# Altium schematic sheet ESP32-S3.SchDoc
size A4; SheetNumber: 2; SheetTotal: 7
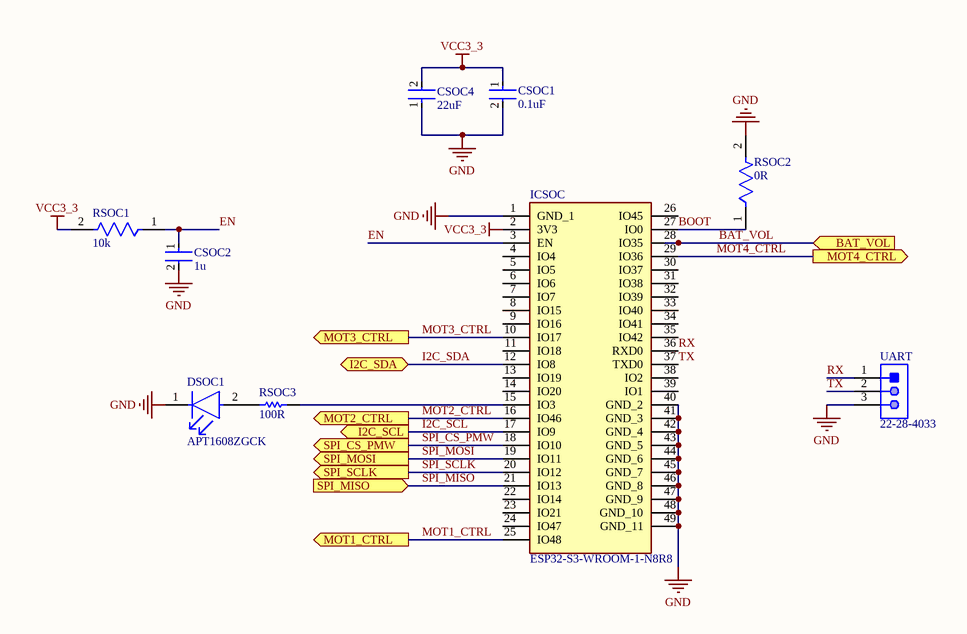
[diagram p0: ESP32-S3.SchDoc]

## Parts
CSOC1  0.1uF  [FP-CL10-IPC_C]
CSOC2  1u  [FP-CL10-IPC_A]
CSOC4  22uF  [FP-GRM188-0_2-IPC_C]
DSOC1  APT1608ZGCK  [FP-APT1608ZGCK-MFG]
ICSOC  ESP32-S3-WROOM-1-N8R8  [ESP32S3WROOM1N8R8]
RSOC1  10k  [FP-ERJ3G-IPC_C]
RSOC2  0R  [FP-ERJ-3GEY0R00V-MFG]
RSOC3  100R  [RESC1608X55X30LL15T15]
UART  22-28-4033  [MOLX-22-28-4033_V]

## Ports
BAT_VOL (in), I2C_SCL (out), I2C_SDA (bidir), MOT1_CTRL (out), MOT2_CTRL (out), MOT3_CTRL (out), MOT4_CTRL (out), SPI_CS_PMW (out), SPI_MISO (in), SPI_MOSI (out), SPI_SCLK (out)

## Nets
GND: CSOC1.2 CSOC2.2 CSOC4.1 DSOC1.1(C) ICSOC.1(GND_1) ICSOC.40(GND_2) ICSOC.41(GND_3) ICSOC.42(GND_4) ICSOC.43(GND_5) ICSOC.44(GND_6) ICSOC.45(GND_7) ICSOC.46(GND_8) ICSOC.47(GND_9) ICSOC.48(GND_10) ICSOC.49(GND_11) RSOC2.2 UART.3
VCC3_3: CSOC1.1 CSOC4.2 ICSOC.2(3V3) RSOC1.2
BAT_VOL: ICSOC.28(IO35) ; port BAT_VOL
BOOT: ICSOC.27(IO0) RSOC2.1
EN: CSOC2.1 ICSOC.3(EN) RSOC1.1
I2C_SCL: ICSOC.17(IO9) ; port I2C_SCL
I2C_SDA: ICSOC.12(IO8) ; port I2C_SDA
MOT1_CTRL: ICSOC.25(IO48) ; port MOT1_CTRL
MOT2_CTRL: ICSOC.16(IO46) ; port MOT2_CTRL
MOT3_CTRL: ICSOC.10(IO17) ; port MOT3_CTRL
MOT4_CTRL: ICSOC.29(IO36) ; port MOT4_CTRL
RX: ICSOC.36(RXD0) UART.1
SPI_CS_PMW: ICSOC.18(IO10) ; port SPI_CS_PMW
SPI_MISO: ICSOC.21(IO13) ; port SPI_MISO
SPI_MOSI: ICSOC.19(IO11) ; port SPI_MOSI
SPI_SCLK: ICSOC.20(IO12) ; port SPI_SCLK
TX: ICSOC.37(TXD0) UART.2
NetDSOC1_2: DSOC1.2(A) RSOC3.2
NetICSOC_15: ICSOC.15(IO3) RSOC3.1

Not connected (* = marked no-connect by the designer): ICSOC 4(IO4) 5(IO5) 6(IO6) 7(IO7) 8(IO15) 9(IO16) 11(IO18) 13(IO19) 14(IO20) 22(IO14) 23(IO21) 24(IO47) 26(IO45) 30(IO37) 31(IO38) 32(IO39) 33(IO40) 34(IO41) 35(IO42) 38(IO2) 39(IO1)

## Library data of the parts
CSOC1 = CMP-13271-001724-1: Cap Ceramic 100nF 50V X7R ±20% Pad SMD 0603 +125°C T/R; Mount: Surface Mount; Lead Free: Lead Free; Max Operating Temperature: 125°C; Voltage Rating: 50V; Case Code (Imperial): 0603; Capacitance: 100nF; Height: 0.8mm; Length: 1.6mm; Tolerance: 20%; Case Code (Metric): 1608; Thickness: 0.035inch; Depth: 0.8mm; Width: 0.031inch; Package Quantity: 1; Min Operating Temperature: -55°C; Case/Package: 0603; Radiation Hardening: No; Voltage Rating (DC): 50V; Dielectric: X7R; Packaging: Tape and Reel
CSOC2 = CMP-13271-001174-1: Cap Ceramic 1uF 25V X5R ±10% Pad SMD 0603 +85°C T/R; Min Operating Temperature: -55°C; Dielectric: X5R; Mount: Surface Mount; Lead Free: Lead Free; Capacitance: 1uF; Height: 0.8mm; Case/Package: 0603; Depth: 0.8mm; Radiation Hardening: No; Width: 0.031inch; Tolerance: 10%; Voltage Rating: 25V; Thickness: 0.035inch; Max Operating Temperature: 85°C; Packaging: Tape and Reel; Package Quantity: 15000; Length: 1.6mm; Voltage Rating (DC): 25V
CSOC4 = CMP-2000-06337-3: Chip Multilayer Ceramic Capacitors for General Purpose, 0603, 22uF, X5R, 15%, 20%, 10V; Tolerance: 20%; Weight: 0.000222oz; Material: Ceramic; Depth: 0.8mm; Length: 1.6mm; Termination: SMD/SMT; Capacitance: 22uF; Packaging: Tape and Reel; Width: 0.8mm; Voltage Rating: 10V; Case Code (Imperial): 0603; Mount: Surface Mount; Voltage Rating (DC): 10V; Case/Package: 0603; Thickness: 0.039inch; REACH SVHC: No SVHC; Dielectric: X5R; Height: 0.8mm; Package Quantity: 4000; Case Code (Metric): 1608; Min Operating Temperature: -55°C; Lead Free: Lead Free; Max Operating Temperature: 85°C
DSOC1 = CMP-44529-000024-1: LED GREEN CLEAR CHIP SMD; Forward Voltage: 3.3V; Dominant Wavelength: 525nm; Forward Current: 20mA; Lens Color: Colorless; Viewing Angle: 120°; Luminous Intensity: 350mcd; Lens Transparency: Clear; Color: Green; Max Operating Temperature: 85°C; Case/Package: 0603; Mount: Surface Mount; Min Operating Temperature: -40°C; Case Code (Metric): 1608; Test Current: 20mA; Packaging: Tape and Reel; Width: 0.8mm; Package Quantity: 1; Height: 0.75mm; Length: 1.6mm; Illumination Color: Green; Lead Free: Lead Free; Case Code (Imperial): 0603
ICSOC = CMP-006-000000-1: Integrated Circuit; Manufacturer_Name: Espressif Systems; Datasheet Link: https://www.espressif.com/sites/default/files/documentation/esp32-s3-wroom-1_wroom-1u_datasheet_en.pdf; Source: SamacSys.SchLib; Manufacturer_Part_Number: ESP32-S3-WROOM-1-N8R8; Height: 3.25mm; Design Item ID: ESP32-S3-WROOM-1-N8R8
RSOC1 = CMP-2000-00704-2: RES SMD 10K OHM 5% 1/10W 0603; Temperature Coefficient: 200ppm/°C; Max Power Dissipation: 100mW; Resistance: 10kR; Voltage Rating (DC): 50V; Voltage Rating: 75V; Resistor Type: Thick Film; Tolerance: 5%; Military Standard: Not; Package Quantity: 1; Max Operating Temperature: 155°C; Mount: Surface Mount; Technology: THICK FILM; Case/Package: 0603; Construction: Rectangular; Depth: 0.8mm; Case Code (Imperial): 0603; Weight: 7.1E-05oz; Features: Automotive AEC-Q200; Packaging: Tape and Reel; Width: 0.8mm; Length: 1.6mm; Termination: SMD/SMT; Power Rating: 100mW; Lead Free: Lead Free; Number of Terminations: 2; Height: 0.45mm; RoHS Compliant: Yes; Min Operating Temperature: -55°C; Contact Plating: Tin; REACH SVHC: No SVHC; Resistance Tolerance: 5%; Series: ERJ; Working Voltage: 75V; Case Code (Metric): 1608
RSOC2 = CMP-2000-00700-2: RES SMD 0 OHM JUMPER 1/10W 0603; Manufacturer Part Number: ERJ-3GEY0R00V; Manufacturer: Panasonic; Tolerance: 5%; Description: 0 Ohms Jumper 0.1W, 1/10W Chip Resistor 0603 (1608 Metric) Automotive AEC-Q200 Thick Film; Automotive Grade: Grade 0; Voltage Rating: 75V; Value: 0Ω; Temperature Coefficient: -100/+600ppm/°C; Power Rating: 0.1W; Mouser Description: Resistor, Chip Thick Film, 0 Ohm, 0.1w, Resistor, Chip Thick Film, 0 Ohm, 0.1w, 5%; Ipc Land Pattern Name: RESC16080X45; Category: Res; Package: 0603; Temperature: -55°C to +155°C; Temperature Range Low: -55°C; Series: ERJ; Resistance: 0Ω; RoHS: TRUE; Composition: Thick Film; Octopart: https://octopart.com/erj-3gey0r00v-panasonic-55389238; Device Class L1: Passive Components; Footprint Url: https://industrial.panasonic.com/cdbs/www-data/pdf/RDA0000/DMA0000COL17.pdf; ComponentLink2Description: Datasheet; Device Class L2: Resistors; Temperature Range High: +155°C; Digikey Description: RES SMD 0 OHM JUMPER 1/10W 0603; Lead Free: Yes; Device Class L3: Chip SMD Resistors; Height: 0.55mm; ComponentLink2URL: https://industrial.panasonic.com/cdbs/www-data/pdf/RDA0000/AOA0000C301.pdf; Automotive: Yes
RSOC3 = CMP-2000-00179-1: Manufacturer: Panasonic; Part Number: ERJ-3EKF1000V
UART = CMP-1676-00001-5: Male Header, Pitch 2.54 mm, 1 x 3 Position, Height 8.38 mm, Tail Length 3.18 mm, RoHS, Bulk; Manufacturer: Molex; Rows: 1; Voltage Rating: 250 V; Current Rating: 4 A; Min Operating Temperature: 0 degC; Lead Pitch: 0.1 inch; Packaging: Bulk; Contact Finish: Gold; RoHSCompliant: true; Contact Material: Brass; PackageReference: 22-28-4033; REACH SVHC: Unknown; PackageDescription: Male Header, Pitch 2.54 mm, 1 x 3 Position, Height 8.38 mm, Tail Length 3.18 mm; ComponentLink2URL: http://www.molex.com/pdm_docs/sd/022284033_sd.pdf; Height: 8.38 mm; Mounting Technology: Through Hole; ComponentLink1Description: Manufacturer URL; Length: 7.62 mm; Mount: Through Hole; DatasheetVersion: Rev. G, 01/2012; Max Operating Temperature: 75 degC; ComponentLink2Description: Datasheet; Colour: Black; Pins: 3; Contact Plating: Gold; Package Quantity: 1; ComponentLink1URL: http://www.molex.com/